# EasyEDA Pro project Modular-Analog-Synthesizer.eprj, schematic Schematic3
Board Name: VCA; Create Date: 2026-04-04; Page Name: VCA-circuit; Project Name: Modular-Analog-Synthesizer; Schematic Name: Schematic3; Update Date: 2026-04-13; Company: EasyEDA.com; Page Size: A4; Version: V1.0
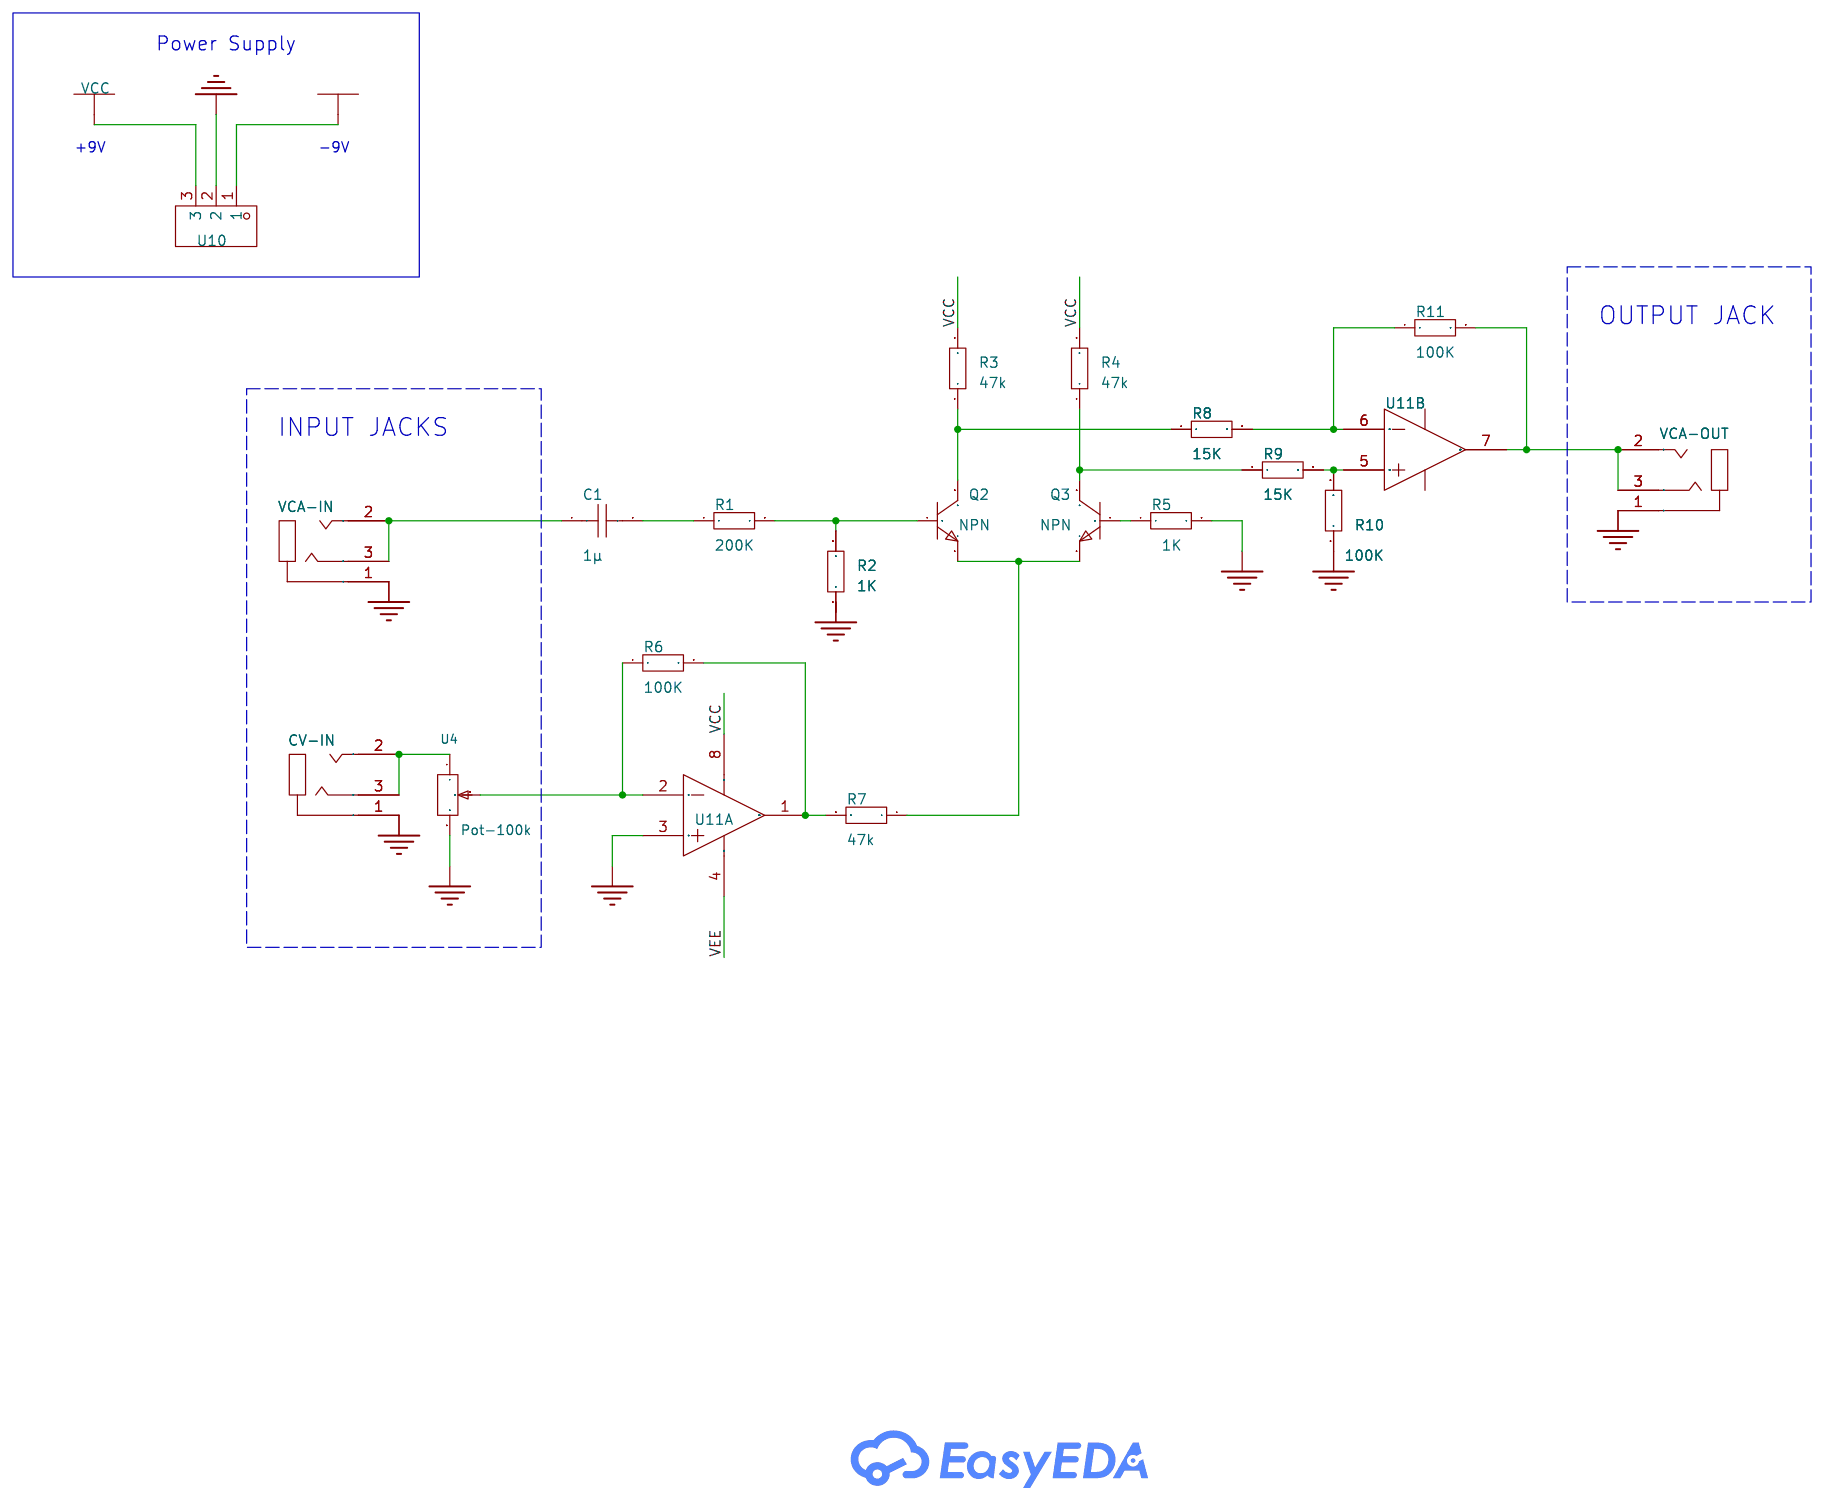
[diagram p2: schematic sheet]

## Parts
C1  1μ  [C0603]
CV-IN  -  [AUDIO-SMD_PJ-313D]
Q2  NPN  [SOT-23-3_L2.9-W1.3-P1.90-LS2.4-BR]
Q3  NPN  [SOT-23-3_L2.9-W1.3-P1.90-LS2.4-BR]
R1  200K  [R0603]
R2  1K  [R0603]
R3  47k  [R0603]
R4  47k  [R0603]
R5  1K  [R0603]
R6  100K  [R0603]
R7  47k  [R0603]
R8  15K  [R0603]
R9  15K  [R0603]
R10  100K  [R0603]
R11  100K  [R0603]
U4  Pot-100k  [RES-ADJ-SMD_VG039NCH]
U10  -  [CONN-TH_3P-P5.00_KF301-5.0-3P]
U11  -  [DIP-8_L9.6-W6.4-P2.54-LS7.6-BL-1]  (sections 1,2)
VCA-IN  -  [AUDIO-SMD_PJ-313D]
VCA-OUT  -  [AUDIO-SMD_PJ-313D]

## Library data of the parts
C1 = CAP_0603: Supplier Footprint: 0603
CV-IN VCA-IN VCA-OUT = PJ-313D-6A: LCSC Part Name: 3.5mm耳机座; Supplier Part: C95463; Manufacturer: 韩国韩荣; Supplier Footprint: SMD; JLCPCB Part Class: Extended Part; Datasheet: https://atta.szlcsc.com/upload/public/pdf/source/20191118/C95463_33C76E25D98A90BB88D1795912C97EA2.pdf; Supplier: LCSC; Connector Type: 3.5mm耳机座; Current Rating (Max): 500mA; Voltage Rating (Max): 30V
Q2 Q3 = MMBT5551: LCSC Part Name: MMBT5551 G1 H档200-300 G1 H档200-300; Supplier Part: C2145; Manufacturer: CJ（江苏长电/长晶）; Supplier Footprint: SOT-23(SOT-23-3); JLCPCB Part Class: Basic Part; Datasheet: https://atta.szlcsc.com/upload/public/pdf/source/20140809/1457707209203.pdf; Supplier: LCSC; Collector Cut-Off Current (Icbo): 50nA; Collector-Emitter Saturation Voltage (VCE(sat)@Ic,Ib): 200mV@50mA,5mA; DC Current Gain (hFE@Ic,Vce): 200@10mA,5V; Transition Frequency (fT): 100MHz; Operating Temperature: +150℃@(Tj)
R1-R11 = Res_0603: Supplier Footprint: 0603
U4 = 3*3Potentiometer-10kΩ20%: Supplier Part: C9900010776; Supplier Footprint: SMD-3P; JLCPCB Part Class: Extended Part; Supplier: LCSC
U10 = KF301-5.0-3P: LCSC Part Name: 5mm 排数:1 每排P数:3 直针 可拼接 铜 环保; Supplier Part: C474882; Manufacturer: KEFA(科发); Supplier Footprint: P=5mm; JLCPCB Part Class: Extended Part; Datasheet: https://atta.szlcsc.com/upload/public/pdf/source/20200115/C474882_067BD45A25E5311BED9DE634CF3E69D8.pdf; Supplier: LCSC; Pitch: 5mm; Number of Rows: 1; Number of PINs Per Row: 3; Mounting Style: 直针; Current Rating (Max): 17A; Voltage Rating (Max): 250V; Wire Gauge - AWG: 14~22; Wire Gauge - mm?: 1.5; Operating Temperature Range: -30℃~+120℃; Color: Blue
U11 = TL072CP: Supplier Part: C7236; Manufacturer: TI(德州仪器); Supplier Footprint: DIP-8; JLCPCB Part Class: Extended Part; Datasheet: https://atta.szlcsc.com/upload/public/pdf/source/20140704/1457707129967.pdf; Supplier: LCSC

## Nets
GND: CV-IN.1 R2.1 R5.2 R10.1 U4.3 U10.2 U11.3(IN1+) VCA-IN.1 VCA-OUT.1
VCC: R3.2 R4.2 U10.3 U11.8(VCC+)
VEE: U10.1 U11.4(VCC-)
$1N3465: Q2.1(B) R1.2 R2.2
$1N3675: Q2.2(E) Q3.2(E) R7.1
$1N3966: CV-IN.2 CV-IN.3 U4.1
$1N4074: R6.1 U4.2 U11.2(IN1-)
$1N4181: R6.2 R7.2 U11.1(OUT1)
$1N4282: Q3.1(B) R5.1
$1N4493: R8.2 R11.1 U11.6(IN2-)
$1N4498: Q2.3(C) R3.1 R8.1
$1N4525: R9.2 R10.2 U11.5(IN2+)
$1N4530: Q3.3(C) R4.1 R9.1
$1N4641: R11.2 U11.7(OUT2) VCA-OUT.2 VCA-OUT.3
$1N5299: C1.1 VCA-IN.2 VCA-IN.3
$1N5302: C1.2 R1.1

## Notes on the sheet
- Power Supply
- +9V
- -9V
- OUTPUT JACK
- INPUT JACKS
